# EAGLE board iMX233-OLinuXino-Mini_Rev_A (EAGLE 4.16), part 1 of 2
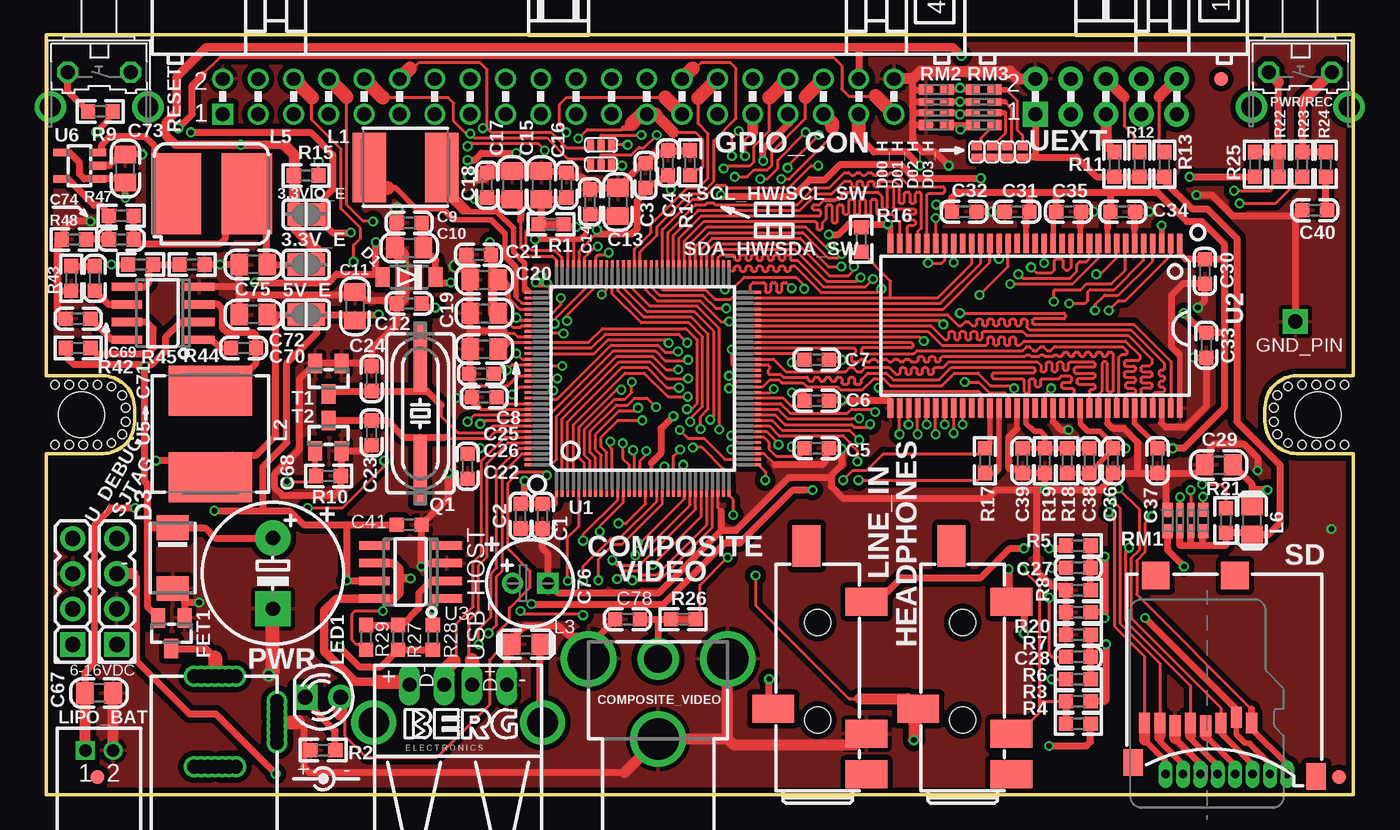
[diagram p1: board, top side]
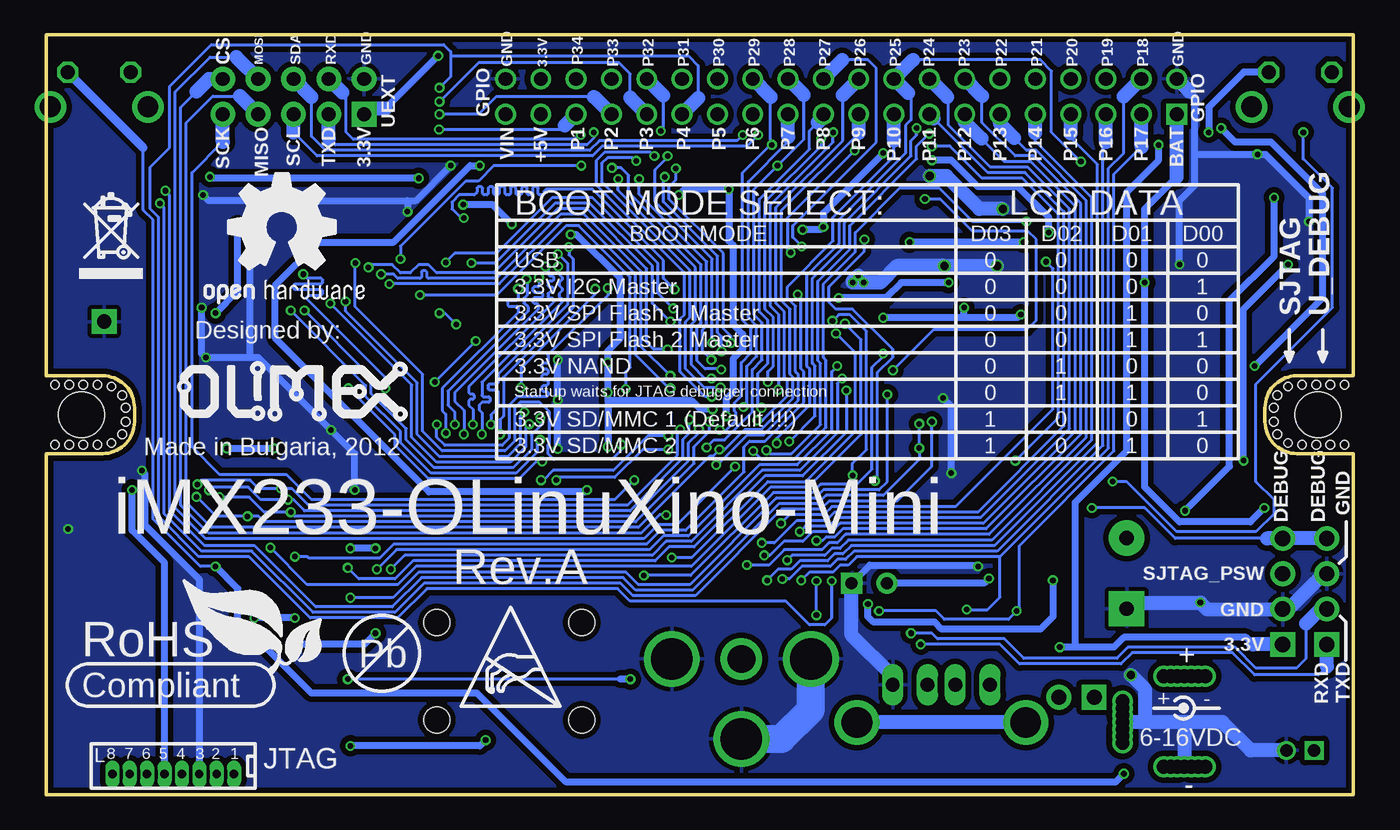
[diagram p2: board, bottom side, seen from below]

Size 93.98 x 54.61 mm. Coordinates in mm from the lower left corner, seen from the top.
Copper layers (1*16): Top 0.035mm / dielectric 0.5mm / Bottom 0.035mm
Design rules "default": minimum track width 0.0051mm, minimum drill 0.3mm, track to track 0.15mm, track to pad 0.2mm, pad to pad 0.2mm, via to via 0.2mm, smd to smd 1mil, copper to edge 10mil, drill to drill 8mil, minimum pad ring 6mil, minimum via ring 0.15mm, stop-mask expansion 4mil, vias tented up to drill 25mil, thermal gap 12mil
Net classes: 1 pwr: width 0.5 mm, clearance 0.24 mm

## Footprints (pad centres in the part's own frame; a part is rotated, then mirrored left to right if it is on the bottom)
SJ = smd 1.168 x 1.6: 1 -0.762,0; 2 0.762,0
C0603_DWS = smd 1.016 x 1.016: 1 -0.889,0; 2 0.889,0
C0805_5MIL_DWS = smd 1.27 x 1.524: 1 -1.016,0; 2 1.016,0
C0603_5MIL = smd 1.016 x 1.016: 1 -0.889,0; 2 0.889,0
E5-10,5 = drill 1.016 pad 2.54 round: + -2.54,0 | drill 1.016 pad 2.54 square: - 2.54,0
E2,5-6,3 = drill 0.864 pad 1.524 round: + -1.27,0 | drill 0.864 pad 1.524 square: - 1.27,0
VIDEO_CON = drill 3 round: GND1 -5,-5.75; GND2 0,0; GND3 5,-5.75 | drill 2 round: IO 0,-5.75
SJ_1_SMALLER = smd 0.508 x 0.762: 1 -0.381,0; 2 0.381,0
SOD-123 = smd 1 x 1.4: A 1.9,0; C -1.9,0
DO214AA = smd 1.778 x 2.286: A 2.177,0; C -2.177,0
SOT23 = smd 1 x 1.4: 1 -0.95,-1.1; 2 0.95,-1.1; 3 0,1.1
TEST_PAD40/70/SQUARE = drill 1.016 pad 1.778 square: P$1 0,0
BH40R = drill 1 square: 1 -24.13,-1.27 | drill 1 round: 2 -24.13,1.27; 3 -21.59,-1.27; 4 -21.59,1.27; 5 -19.05,-1.27; 6 -19.05,1.27; 7 -16.51,-1.27; 8 -16.51,1.27; 9 -13.97,-1.27; 10 -13.97,1.27; 11 -11.43,-1.27; 12 -11.43,1.27; 13 -8.89,-1.27; 14 -8.89,1.27; 15 -6.35,-1.27; 16 -6.35,1.27; 17 -3.81,-1.27; 18 -3.81,1.27; 19 -1.27,-1.27; 20 -1.27,1.27; 21 1.27,-1.27; 22 1.27,1.27; 23 3.81,-1.27; 24 3.81,1.27; 25 6.35,-1.27; 26 6.35,1.27; 27 8.89,-1.27; 28 8.89,1.27; 29 11.43,-1.27; 30 11.43,1.27; 31 13.97,-1.27; 32 13.97,1.27; 33 16.51,-1.27; 34 16.51,1.27; 35 19.05,-1.27; 36 19.05,1.27; 37 21.59,-1.27; 38 21.59,1.27; 39 24.13,-1.27; 40 24.13,1.27
PJ-W47S-05D2-LF_5PIN_V2 = smd 2 x 3: 1 2.1,-0.5; 2 14.5,-0.5; 3 6.8,6.2; 5 5,-0.5 | smd 3 x 2: 4 18.5,3.8 | hole 1.9: 6,3; 13,3
WU08S = drill 0.6 pad 0.991 long: 1 -4.375,0; 2 -3.125,0; 3 -1.875,0; 4 -0.625,0; 5 0.625,0; 6 1.875,0; 7 3.125,0; 8 4.375,0
L5852 = smd 2.4 x 5: 1 -2.6,0; 2 2.6,0
8X8MM_3131 = smd 3.6 x 6: 1 -3.1,0; 2 3.1,0
L0805_5MIL_DWS = smd 1.27 x 1.524: 1 -1.016,0; 2 1.016,0
SD75 = smd 5.8 x 3.6: 1 0,2.55; 2 0,-2.55
LED-3.0MM = drill 1.092 pad 1.778 round: A -1.27,0 | drill 1.092 pad 1.778 square: K 1.27,0
DW02R = drill 0.9 square: 1 -1,0 | drill 0.9 round: 2 1,0
PWR_JACK_UNI_MILLING = drill 1 round: + 0,4.75; +1 0,5.25; +2 0,5.75; +3 0,6.25; +4 0,4.25; +5 0,3.75; +6 0,3.25; - -6.5,4.75; -1 -6.5,5.25; -2 -6.5,5.75; -3 -6.5,4.25; -4 -6.5,3.75; -5 -6.5,6.25; -6 -6.5,3.25; -- -3.3,0.3; --1 -3.8,0.3; --2 -4.3,0.3; --3 -4.8,0.3; --4 -2.8,0.3; --5 -2.3,0.3; --6 -1.8,0.3
B3F-31XX = drill 1.016 octagon: 1 -2.261,-1.245; 2 2.261,-1.245 | drill 1.499 pad 2.159 round: 3 -3.505,1.245; 4 3.505,1.245
HC49/SMD2_THIN = smd 5 x 1: 1 -4.064,0; 2 4.064,0
0603_0R = smd 1.016 x 1.016: 1 -0.889,0; 2 0.889,0
R0603_5MIL_DWS = smd 1.016 x 1.016: 1 -0.889,0; 2 0.889,0
R0603_5MIL_DWS_NA = smd 1.016 x 1.016: 1 -0.889,0; 2 0.889,0
R0603_5MIL = smd 1.016 x 1.016: 1 -0.889,0; 2 0.889,0
R_MATRIX_4 = smd 1.016 x 0.762: 1.1 -0.762,1.27; 1.2 0.762,1.27; 4.1 -0.762,-1.27; 4.2 0.762,-1.27 | smd 1.016 x 0.508: 2.1 -0.762,0.381; 2.2 0.762,0.381; 3.1 -0.762,-0.381; 3.2 0.762,-0.381
SJ_2_SMALLER = smd 0.508 x 0.762: 1 -0.762,0; 2 0,0; 3 0.762,0
TFR-MEM-CON = smd 0.8 x 1.5: 1 -3.2,10.7; 2 -2.1,10.3; 3 -1,10.7; 4 0.1,10.9; 5 1.2,10.7; 6 2.3,10.9; 7 3.4,10.7; 8 4.5,10.7 | smd 2 x 2: 9 3.7,0.1; 10 -2,0.1 | smd 1.4 x 1.9: 11 5.3,13.55; 12 -7.85,14.55
HN1X4 = drill 1.1 pad 1.778 square: 1 -3.81,0 | drill 1.1 pad 1.778 round: 2 -1.27,0; 3 1.27,0; 4 3.81,0
TQFP128LD = smd 0.2 x 1.5: 1 -6.2,-7.75; 2 -5.8,-7.75; 3 -5.4,-7.75; 4 -5,-7.75; 5 -4.6,-7.75; 6 -4.2,-7.75; 7 -3.8,-7.75; 8 -3.4,-7.75; 9 -3,-7.75; 10 -2.6,-7.75; 11 -2.2,-7.75; 12 -1.8,-7.75; 13 -1.4,-7.75; 14 -1,-7.75; 15 -0.6,-7.75; 16 -0.2,-7.75; 17 0.2,-7.75; 18 0.6,-7.75; 19 1,-7.75; 20 1.4,-7.75; 21 1.8,-7.75; 22 2.2,-7.75; 23 2.6,-7.75; 24 3,-7.75; 25 3.4,-7.75; 26 3.8,-7.75; 27 4.2,-7.75; 28 4.6,-7.75; 29 5,-7.75; 30 5.4,-7.75; 31 5.8,-7.75; 32 6.2,-7.75; 65 6.2,7.75; 66 5.8,7.75; 67 5.4,7.75; 68 5,7.75; 69 4.6,7.75; 70 4.2,7.75; 71 3.8,7.75; 72 3.4,7.75; 73 3,7.75; 74 2.6,7.75; 75 2.2,7.75; 76 1.8,7.75; 77 1.4,7.75; 78 1,7.75; 79 0.6,7.75; 80 0.2,7.75; 81 -0.2,7.75; 82 -0.6,7.75; 83 -1,7.75; 84 -1.4,7.75; 85 -1.8,7.75; 86 -2.2,7.75; 87 -2.6,7.75; 88 -3,7.75; 89 -3.4,7.75; 90 -3.8,7.75; 91 -4.2,7.75; 92 -4.6,7.75; 93 -5,7.75; 94 -5.4,7.75; 95 -5.8,7.75; 96 -6.2,7.75 | smd 1.5 x 0.2: 33 7.75,-6.2; 34 7.75,-5.8; 35 7.75,-5.4; 36 7.75,-5; 37 7.75,-4.6; 38 7.75,-4.2; 39 7.75,-3.8; 40 7.75,-3.4; 41 7.75,-3; 42 7.75,-2.6; 43 7.75,-2.2; 44 7.75,-1.8; 45 7.75,-1.4; 46 7.75,-1; 47 7.75,-0.6; 48 7.75,-0.2; 49 7.75,0.2; 50 7.75,0.6; 51 7.75,1; 52 7.75,1.4; 53 7.75,1.8; 54 7.75,2.2; 55 7.75,2.6; 56 7.75,3; 57 7.75,3.4; 58 7.75,3.8; 59 7.75,4.2; 60 7.75,4.6; 61 7.75,5; 62 7.75,5.4; 63 7.75,5.8; 64 7.75,6.2; 97 -7.75,6.2; 98 -7.75,5.8; 99 -7.75,5.4; 100 -7.75,5; 101 -7.75,4.6; 102 -7.75,4.2; 103 -7.75,3.8; 104 -7.75,3.4; 105 -7.75,3; 106 -7.75,2.6; 107 -7.75,2.2; 108 -7.75,1.8; 109 -7.75,1.4; 110 -7.75,1; 111 -7.75,0.6; 112 -7.75,0.2; 113 -7.75,-0.2; 114 -7.75,-0.6; 115 -7.75,-1; 116 -7.75,-1.4; 117 -7.75,-1.8; 118 -7.75,-2.2; 119 -7.75,-2.6; 120 -7.75,-3; 121 -7.75,-3.4; 122 -7.75,-3.8; 123 -7.75,-4.2; 124 -7.75,-4.6; 125 -7.75,-5; 126 -7.75,-5.4; 127 -7.75,-5.8; 128 -7.75,-6.2
66TSOP-II = smd 0.4 x 1.4: 1 -10.4,-5.925; 2 -9.75,-5.925; 3 -9.1,-5.925; 4 -8.45,-5.925; 5 -7.8,-5.925; 6 -7.15,-5.925; 7 -6.5,-5.925; 8 -5.85,-5.925; 9 -5.2,-5.925; 10 -4.55,-5.925; 11 -3.9,-5.925; 12 -3.25,-5.925; 13 -2.6,-5.925; 14 -1.95,-5.925; 15 -1.3,-5.925; 16 -0.65,-5.925; 17 0,-5.925; 18 0.65,-5.925; 19 1.3,-5.925; 20 1.95,-5.925; 21 2.6,-5.925; 22 3.25,-5.925; 23 3.9,-5.925; 24 4.55,-5.925; 25 5.2,-5.925; 26 5.85,-5.925; 27 6.5,-5.925; 28 7.15,-5.925; 29 7.8,-5.925; 30 8.45,-5.925; 31 9.1,-5.925; 32 9.75,-5.925; 33 10.4,-5.925; 34 10.4,5.925; 35 9.75,5.925; 36 9.1,5.925; 37 8.45,5.925; 38 7.8,5.925; 39 7.15,5.925; 40 6.5,5.925; 41 5.85,5.925; 42 5.2,5.925; 43 4.55,5.925; 44 3.9,5.925; 45 3.25,5.925; 46 2.6,5.925; 47 1.95,5.925; 48 1.3,5.925; 49 0.65,5.925; 50 0,5.925; 51 -0.65,5.925; 52 -1.3,5.925; 53 -1.95,5.925; 54 -2.6,5.925; 55 -3.25,5.925; 56 -3.9,5.925; 57 -4.55,5.925; 58 -5.2,5.925; 59 -5.85,5.925; 60 -6.5,5.925; 61 -7.15,5.925; 62 -7.8,5.925; 63 -8.45,5.925; 64 -9.1,5.925; 65 -9.75,5.925; 66 -10.4,5.925
SOIC8 = smd 0.6 x 2.2: 1 -1.905,-2.6; 2 -0.635,-2.6; 3 0.635,-2.6; 4 1.905,-2.6; 5 1.905,2.6; 6 0.635,2.6; 7 -0.635,2.6; 8 -1.905,2.6
SOT23-5 = smd 0.55 x 1.2: 1 -0.95,-1.3; 2 0,-1.3; 3 0.95,-1.3; 4 0.95,1.3; 5 -0.95,1.3
FIDUCIAL-1X2 = smd 1 x 1: 1 0,0
JM42_PACTEC-101X61X25_MILLED = hole 3.3: 2.54,27.305; 91.44,27.305 | hole 0.6: 0.635,29.464; 1.651,29.464; 2.667,29.464; 3.683,29.464; 4.699,29.337; 5.461,28.702; 5.715,27.813; 5.715,26.797; 5.461,25.908; 4.699,25.273; 3.683,25.146; 2.667,25.146; 1.651,25.146; 0.635,25.146; 93.345,29.464; 92.329,29.464; 91.313,29.464; 90.297,29.464; 89.281,29.337; 88.519,28.702; 88.265,27.813; 88.265,26.797; 88.519,25.908; 89.281,25.273; 90.297,25.146; 91.313,25.146; 92.329,25.146; 93.345,25.146
BH10R = drill 1 pad 1.778 square: 1 -5.08,-1.27 | drill 1 pad 1.778 round: 2 -5.08,1.27; 3 -2.54,-1.27; 4 -2.54,1.27; 5 0,-1.27; 6 0,1.27; 7 2.54,-1.27; 8 2.54,1.27; 9 5.08,-1.27; 10 5.08,1.27
USB_PN87520_HOST_PTH = drill 1 long: 1 -3.5,2.71; 2 -1,2.71; 3 1,2.71; 4 3.5,2.71 | drill 2.2 round: P$1 6.07,0; P$2 -6.07,0

## Placement (x,y rotation side)
3.3V_E  Open  [SJ]  18.7,38.1 0 top
3.3VIO_E  Open  [SJ]  18.7,41.7 0 top
5V_E  Open  [SJ]  18.7,34.5 0 top
C1  100nF  [C0603_DWS]  35.7,20.02 90 top
C2  100nF  [C0603_DWS]  34.1,20.02 90 top
C3  100nF  [C0603_DWS]  43.1,44.5 270 top
C4  100nF  [C0603_DWS]  44.7,45.4 270 top
C5  100nF  [C0603_DWS]  55.4,24.9 180 top
C6  100nF  [C0603_DWS]  55.4,28.3 180 top
C7  100nF  [C0603_DWS]  55.4,31.25 180 top
C8  22uF/6.3V  [C0805_5MIL_DWS]  31.5,32.02 0 top
C9  100nF  [C0603_DWS]  26.1,41.1 0 top
C10  22uF/6.3V  [C0805_5MIL_DWS]  26.1,39.3 0 top
C11  22uF/6.3V  [C0805_5MIL_DWS]  22.2,35.1 270 top
C12  100nF  [C0603_DWS]  26.1,35.3 0 top
C13  22uF/6.3V  [C0805_5MIL_DWS]  41.1,42.6 270 top
C14  100nF  [C0603_DWS]  39.1,42.6 270 top
C15  22uF/6.3V  [C0805_5MIL_DWS]  35.6,43.8 270 top
C16  100nF  [C0603_DWS]  37.4,43.8 270 top
C17  22uF/6.3V  [C0805_5MIL_DWS]  33.5,43.8 270 top
C18  100nF  [C0603_DWS]  31.7,43.8 270 top
C19  22uF/6.3V  [C0805_5MIL_DWS]  31.5,34.6 0 top
C20  22uF/6.3V  [C0805_5MIL_DWS]  31.5,37 0 top
C21  100nF  [C0603_DWS]  31.1,38.8 0 top
C22  100nF  [C0603_DWS]  30.3,23.6 90 top
C23  33pF  [C0603_DWS]  23.4,26 90 top
C24  33pF  [C0603_DWS]  23.4,29.9 270 top
C25  100nF  [C0603_DWS]  31.3,30.25 0 top
C26  1uF  [C0603_DWS]  31.5,28.55 0 top
C27  1uF  [C0603_DWS]  74.2,16.3 180 top
C28  1uF  [C0603_DWS]  74.2,9.9 180 top
C29  22uF/6.3V  [C0805_5MIL_DWS]  84.3,23.7 0 top
C30  100nF  [C0603_DWS]  83.3,37.6 90 top
C31  100nF  [C0603_DWS]  69.8,41.9 0 top
C32  100nF  [C0603_DWS]  66,41.9 180 top
C33  100nF  [C0603_DWS]  83.4,32.3 90 top
C34  100nF  [C0603_DWS]  77.4,41.9 180 top
C35  100nF  [C0603_DWS]  73.5,41.9 180 top
C36  100nF  [C0603_DWS]  76.7,24 90 top
C37  100nF  [C0603_DWS]  79.9,24 90 top
C38  100nF  [C0603_DWS]  75,24 90 top
C39  100nF  [C0603_DWS]  70.2,24 90 top
C40  100nF  [C0603_DWS]  91.2,42 180 top
C41  100nF  [C0603_5MIL]  26.1,19.4 0 top
C67  22uF/6.3V  [C0805_5MIL_DWS]  3.8,7.3 180 top
C68  470uF/25V/LOWESR/105C  [E5-10,5]  16.3,15.9 270 top
C69  100nF  [C0603_DWS]  2.3,34.2 180 top
C70  10nF  [C0603_DWS]  14.2,32.1 0 top
C71  3.3nF  [C0603_DWS]  3.5,37.1 90 top
C72  22uF/6.3V  [C0805_5MIL_DWS]  14.9,34.5 180 top
C73  22uF/6.3V  [C0805_5MIL_DWS]  5.7,45 90 top
C74  22pF  [C0603_DWS]  5.4,39.9 180 top
C75  22uF/6.3V  [C0805_5MIL_DWS]  14.9,38.1 180 top
C76  100uF/35V/LOWESR/105C/6.3x11mm_RM2.5  [E2,5-6,3]  34.8,15.2 0 top
C78  51pF  [C0603_DWS]  41.8,12.6 180 top
COMPOSITE_VIDEO  VIDEO_CON  [VIDEO_CON]  44,4 180 top
D00_H  Close  [SJ_1_SMALLER]  66.9,46.2 270 top
D1  1N5819(S4SOD-123)  [SOD-123]  26.1,37.2 180 top
D01_H  Open  [SJ_1_SMALLER]  68,46.2 270 top
D02_H  Open  [SJ_1_SMALLER]  69.1,46.2 270 top
D3  SMBJ16A  [DO214AA]  9.1,17 270 top
D03_H  Close  [SJ_1_SMALLER]  70.2,46.2 270 top
FET1  IRLML6402  [SOT23]  9,11.6 180 top
GND_PIN  TESTPAD3  [TEST_PAD40/70/SQUARE]  89.8,34 0 top
GPIO_CON  BH40R  [BH40R]  36.83,50.16 0 top
HEADPHONES  AUDIO_JACK_5PINPJ-W47S-05D2-LF_V2  [PJ-W47S-05D2-LF_5PIN_V2]  68.89,-0.64 90 top
JTAG  NA(WU08S)  [WU08S]  84.85,1.47 180 bottom
L1  15uH/1.3A/20%  [L5852]  25.84,45.09 0 top
L2  10uH/3.15A/20%  [8X8MM_3131]  11.81,25.92 270 top
L3  FB0805/600R/200mA(201209-601)  [L0805_5MIL_DWS]  34.5,10.8 0 top
L5  4.7uH/2.8A/20%  [SD75]  11.88,43.18 90 top
L6  CL470nH/0805/1.76R/250mA  [L0805_5MIL_DWS]  86.7,19.7 90 top
LED1  LED/GREEN/3MM  [LED-3.0MM]  19.9,7 180 top
LINE_IN  AUDIO_JACK_5PINPJ-W47S-05D2-LF_V2  [PJ-W47S-05D2-LF_5PIN_V2]  58.47,-0.64 90 top
LIPO_BAT  DW02R  [DW02R]  3.81,3.17 0 top
PWR  YDJ-1136  [PWR_JACK_UNI_MILLING]  16.89,8.51 90 top
PWR/REC  TV-06B  [B3F-31XX]  90.17,50.67 180 top
Q1  Q24.000MHz/HC-49SM/SMD/20ppm/20pF  [HC49/SMD2_THIN]  26.9,27.4 270 top
R1  0R(Board_Mounted)  [0603_0R]  36.3,41 180 top
R2  560R  [R0603_5MIL_DWS]  19.9,3.2 0 top
R3  110R  [R0603_5MIL_DWS]  74.2,6.7 0 top
R4  110R  [R0603_5MIL_DWS]  74.2,5.1 0 top
R5  10k  [R0603_5MIL_DWS]  74.2,17.9 180 top
R6  10k  [R0603_5MIL_DWS]  74.2,8.3 180 top
R7  4.7k  [R0603_5MIL_DWS]  74.2,11.5 0 top
R8  4.7k  [R0603_5MIL_DWS]  74.2,14.7 0 top
R9  47k  [R0603_5MIL_DWS]  3.9,49.1 180 top
R10  47k  [R0603_5MIL_DWS]  20.3,22.9 0 top
R11  2.2k  [R0603_5MIL_DWS]  76.8,45.3 270 top
R12  2.2k  [R0603_5MIL_DWS]  78.6,45.3 270 top
R13  47k  [R0603_5MIL_DWS]  80.4,45.3 270 top
R14  47k  [R0603_5MIL_DWS]  46.3,45.4 270 top
R15  47k  [R0603_5MIL_DWS]  18.7,44.5 0 top
R16  10k  [R0603_5MIL_DWS]  58.6,39.9 90 top
R17  110R  [R0603_5MIL_DWS]  67.5,24 90 top
R18  1k/1%  [R0603_5MIL_DWS]  73.4,24 270 top
R19  1k/1%  [R0603_5MIL_DWS]  71.8,24 90 top
R20  1M  [R0603_5MIL_DWS]  74.2,13.1 180 top
R21  10k  [R0603_5MIL_DWS]  84.8,19.7 270 top
R22  0R(Board_Mounted)  [0603_0R]  88.6,45.3 270 top
R23  1k  [R0603_5MIL_DWS]  90.3,45.3 90 top
R24  1k  [R0603_5MIL_DWS]  92,45.3 90 top
R25  NA(10k)  [R0603_5MIL_DWS_NA]  86.9,45.3 270 top
R26  0R(Board_Mounted)  [0603_0R]  45.8,12.6 180 top
R27  10K  [R0603_5MIL]  25.3,11.3 270 top
R28  10K  [R0603_5MIL]  27.8,11.3 270 top
R29  1K  [R0603_5MIL]  23,11.3 90 top
R42  47k  [R0603_5MIL_DWS]  2.3,32.1 0 top
R43  2.2k  [R0603_5MIL_DWS]  1.8,37.1 270 top
R44  1.1k/1%  [R0603_5MIL_DWS]  10.5,38.1 0 top
R45  4.99k/1%  [R0603_5MIL_DWS]  6.8,38.1 180 top
R47  4.99k/1%  [R0603_5MIL_DWS]  5.4,41.6 180 top
R48  1.1k/1%  [R0603_5MIL_DWS]  2,39.9 180 top
RESET  TV-06B  [B3F-31XX]  3.81,50.67 180 top
RM1  RA1206_(4X0603)_4B8_100K  [R_MATRIX_4]  81.9,19.7 270 top
RM2  RA1206_(4X0603)_4B8_47K  [R_MATRIX_4]  64,49.4 0 top
RM3  RA1206_(4X0603)_4B8_4.7K  [R_MATRIX_4]  67.4,49.4 0 top
SCL_HW/SCL_SW  SCL_HW:Open/SCL_SW:Close  [SJ_2_SMALLER]  39.9,46.7 0 top
SD  MICRO  [TFR-MEM-CON]  83.46,15.85 180 top
SDA_HW/SDA_SW  SDA_HW:Open/SDA_SW:Close  [SJ_2_SMALLER]  39.9,45.3 0 top
SJTAG  (NA)HN1X4  [HN1X4]  5.08,14.61 90 top
T1  BC846B  [SOT23]  20.3,29.9 180 top
T2  BC846B  [SOT23]  20.3,25.8 0 top
U1  MCIMX233DAG4B_LD  [TQFP128LD]  42.9,29.9 0 top
U2  HY5DU121622D(L)T(P)-J  [66TSOP-II]  71.1,33.7 180 top
U3  MIC2075-2YM  [SOIC8]  26.2,16 90 top
U5  MP1482DS  [SOIC8]  8.4,34.6 90 top
U6  SY8008C(AA)C  [SOT23-5]  2.4,45.2 90 top
U$1  FIDUCIAL1X2  [FIDUCIAL-1X2]  3.68,1.27 180 top
U$2  FIDUCIAL1X2  [FIDUCIAL-1X2]  92.95,1.27 180 top
U$3  FIDUCIAL1X2  [FIDUCIAL-1X2]  84.45,51.44 180 top
U$5  [LOGO-OPENHARDWARE_8X8]  77.05,40.7 0 bottom
U$6  [JM42_PACTEC-101X61X25_MILLED]  0,0 0 top
U$8  [OLIMEX1_V]  66.85,26.73 0 bottom
U$9  [PB]  69.85,10.16 0 bottom
U$10  [ESD_SYMBOL]  64.14,6.35 0 bottom
U$11  [RECYCLE_BIN1/8]  91.6,37.09 0 bottom
U$12  [ROHS]  91.44,6.99 0 bottom
U_DEBUG  NA(HN1X4)  [HN1X4]  1.91,14.61 90 top
UEXT  BH10R  [BH10R]  76.2,50.16 0 top
USB_HOST  USB_A  [USB_PN87520_HOST_PTH]  29.62,5.19 0 top

## Tracks (layer width: path | path; a pad name or v marks a point on that pad's centre or on a via)
+5V  (via drill 0.4)
  Top 0.2: v33.8,34.27 33.98,34.1 U1.102
  Top 0.5: C12.2 27.29,35 v27.99,35 | 21.6,19.4 v21.6,15.4 21.64,15.37 U3.7 | 21.6,19.4 C41.1 | 22.2,34.5 5V_E.2 19.46,33.16 17.3,31 17.3,25.3 15.6,23.6 15.6,20.4 | 22.2,34.5 v23.9,34.5 | 21.6,19.4 18.5,19.4 17.5,20.4 15.6,20.4 | v12.1,20.4 15.6,20.4 | U6.4 1.65,46.15 2.4,45.4 2.4,44.6 2.75,44.25 U6.1 5.43,44.25 C73.1 v5.7,42.9 | v34.9,13.7 44.4,13.7 48.8,18.1 49.9,18.1 53.7,21.9 v55.1,21.9 | v62.8,45.2 61.8,46.2 59.5,46.2 58.42,47.28 | 22.2,34.5 C11.2
  Top 1: 58.42,47.28 GPIO_CON.37
  Bottom 0.5: 27.99,34.27 v33.8,34.27 | 27.99,34.27 v27.99,35 | v23.9,34.5 24.12,34.27 27.99,34.27 | v12.1,20.4 8.9,23.6 8.9,35.5 5.7,38.7 v5.7,42.9 | v21.6,15.4 21.6,12.8 22.5,11.9 29.6,11.9 30.1,12.4 34.5,12.4 34.9,12.8 v34.9,13.7 | v55.1,21.9 55.25,21.75 66.45,21.75 77.5,32.8 77.5,36.6 74.4,39.7 69,39.7 63.5,45.2 v62.8,45.2
+5V_HOST_PWR  (via drill 0.4)
  Top 0.6: 25.4,15.54 25.4,16.2 24.96,16.64 U3.6 | 25.4,15.54 25.4,14.5 25,14.1 U3.8 20.89,14.1 20,13.2 20,10.3 22.2,8.1 23.9,8.1 | 25.4,15.54 v26.2,15.54
  Top 1: USB_HOST.1 26.12,8.1 23.9,8.1
  Bottom 0.5: v26.2,15.54 26.53,15.2 C76.+
+15V  (via drill 0.4)
  Top 0.2: 59.66,50.2 57.7,50.2 57.2,50.7 57.2,52.4 56.6,53 12.5,53 11.3,51.8
  Top 0.5: R42.1 1.6,31.91 1.6,31.3 2,30.9 7.1,30.9 | 7.1,30.9 7.6,30.9 8.6,31.9 8.6,32.9 9.66,33.97 U5.2 | FET1.2 7.3,13.45 7.3,19.18 | 7.3,19.18 D3.C 11.42,19.18 12.16,18.44 C68.+ | 7.3,19.18 7.3,22.3 7.1,22.5 v7.1,30.8 7.1,30.9 | 11.3,51.8 10.5,51 10.5,48.9 v9.5,47.9
  Top 1: 59.66,50.2 GPIO_CON.39
  Bottom 0.5: v9.5,47.9 8.5,46.9 5.9,46.9 2.2,43.2 2.2,35.7 v7.1,30.8
+24V  (via drill 0.4)
  Top 0.2: U1.103 34.2,33.7 34.1,33.6 33.52,33.6 C19.2 | U1.100 34.05,34.9 33.3,35.65 | 33.2,35.9 33.2,35.75 33.3,35.65 | 33.3,35.65 33.3,35.9
  Top 0.4: 32.8,37 33.2,36.6 33.2,35.9
  Top 0.5: C19.2 | C20.2 32.8,37 | C67.2 2.81,7.3 2.81,8.81 3.5,9.5 3.5,19.4 4.7,20.6 v6.4,20.6 | v15,36.8 20.3,36.8 20.9,37.4 23.7,37.4 | 23.7,37.4 v23.7,39.7 | 23.7,37.4 24.2,37.4 D1.A | 31.9,38.8 C21.2
  Top 0.7: 32.1,37 32.1,34.6 C19.2 | 32.3,36.78 C20.2 32.1,37 | v31.9,39.7 31.9,38.8 32.1,38.6 32.1,37
  Top 0.8: LIPO_BAT.1 2.81,7.3
  Bottom 0.5: v6.4,20.6 7.4,19.6 12.5,19.6 15,22.1 v15,36.8 15,42.1 12.7,44.4 | v23.7,39.7 v31.9,39.7
  Bottom 1: 12.7,44.4 GPIO_CON.1
A0
  Top 0.2: U1.76 44.7,40.4 46.7,42.4 47.4,42.4 47.52,42.52 47.98,42.52 48.1,42.4 54,42.4 55.2,43.6 56.3,43.6 57.4,44.7 57.7,44.7 57.9,44.5 58.1,44.5 58.3,44.7 58.5,44.7 58.7,44.5 58.9,44.5 59.1,44.7 59.3,44.7 59.5,44.5 59.7,44.5 59.9,44.7 60.1,44.7 60.3,44.5 60.5,44.5 60.7,44.7 61.1,44.7 62.1,43.7 64.47,43.7 64.58,43.6 64.58,43.3 64.47,43.2 63.4,43.2 63.3,43.1 U2.29
A1
  Top 0.2: U1.75 45.1,40.2 46.9,42 54.2,42 55.4,43.2 56.5,43.2 57.4,44.1 57.77,44.1 57.9,43.98 57.9,43.8 58,43.7 58.2,43.7 58.3,43.8 58.3,44 58.4,44.1 58.6,44.1 58.7,44 58.7,43.8 58.8,43.7 59,43.7 59.1,43.8 59.1,44 59.2,44.1 59.4,44.1 59.5,44 59.5,43.8 59.6,43.7 59.8,43.7 59.9,43.8 59.9,43.98 60.02,44.1 61,44.1 61.3,43.8 61.3,42.6 61.4,42.5 61.6,42.5 61.7,42.6 61.7,43.2 61.8,43.3 62,43.3 62.1,43.2 62.1,42.6 62.2,42.5 62.4,42.5 62.5,42.6 62.5,43.2 62.6,43.3 62.8,43.3 62.9,43.2 62.9,40.7 62.65,40.45 U2.30
A2
  Top 0.2: U1.74 45.5,40 47.1,41.6 55.6,41.6 55.7,41.7 55.7,41.9 55.6,42 55.2,42 55.1,42.1 55.1,42.3 55.2,42.4 55.6,42.4 56,42.8 57.08,42.8 57.2,42.92 57.2,43.17 57.33,43.3 59.8,43.3 60.1,43 60.1,42.2 60.2,42.1 60.4,42.1 60.5,42.2 60.5,43.6 60.6,43.7 60.8,43.7 60.9,43.6 60.9,42.2 61,42.1 62.4,42.1 62.5,42 62.5,41.8 62.4,41.7 61.7,41.7 61.6,41.6 61.6,41.4 61.7,41.3 62.4,41.3 62.5,41.2 62.5,41 62.4,40.9 62,40.9 61.9,40.8 61.9,40.3 62,40.2 U2.31 62,39.6
A3
  Top 0.2: U1.73 45.9,39.8 47.3,41.2 55.3,41.2 55.4,41.1 55.4,40.7 55.5,40.6 55.7,40.6 55.8,40.7 55.8,41.1 56.1,41.4 56.1,42.3 56.2,42.4 56.4,42.4 56.5,42.3 56.5,41.2 56.6,41.1 56.8,41.1 56.9,41.2 56.9,42.3 57,42.4 57.2,42.4 57.3,42.3 57.3,41.8 57.4,41.7 57.6,41.7 57.7,41.8 57.7,42.7 57.8,42.8 58,42.8 58.1,42.7 58.1,41.8 58.2,41.7 58.4,41.7 58.5,41.8 58.5,42.7 58.6,42.8 58.8,42.8 58.9,42.7 58.9,41.8 59,41.7 59.2,41.7 59.3,41.8 59.3,42.7 59.4,42.8 59.6,42.8 59.7,42.7 59.7,41.8 59.8,41.7 60.8,41.7 61.35,41.15 U2.32
A4  (via drill 0.4)
  Top 0.2: v61.35,25.9 U2.35 | U1.72 46.3,39.6 47.5,40.8 54.6,40.8 56.05,39.35 v56.4,39.35
  Bottom 0.2: v56.4,39.35 56.4,38.8 56.1,38.5 56.1,35 61.1,30 61.1,27.2 61.35,26.95 v61.35,25.9
A5  (via drill 0.4)
  Top 0.2: v62,26.6 U2.36 | U1.71 46.7,39.4 47.7,40.4 54.4,40.4 56.2,38.6 56.95,38.6 v57.2,38.85
  Bottom 0.2: v57.2,38.85 57.15,38.85 56.5,38.2 56.5,35.2 61.5,30.2 61.5,29.6 61.6,29.5 62.12,29.5 62.23,29.4 62.23,29.2 62.12,29.1 61.6,29.1 61.5,29 61.5,27.8 62,27.3 v62,26.6
A6  (via drill 0.4)
  Top 0.2: v62.65,25.9 U2.37 | U1.70 47.1,39.2 47.9,40 54.2,40 56.25,37.95 v57.17,37.95
  Bottom 0.2: v57.17,37.95 57.17,37.48 56.9,37.2 56.9,37 57.1,36.8 57.1,36.6 56.9,36.4 56.9,36.2 57.1,36 57.1,35.8 56.9,35.6 56.9,35.4 62.65,29.65 62.65,28.68 62.58,28.6 62.15,28.6 62.05,28.5 62.05,28.3 62.15,28.2 62.65,28.2 62.85,28 62.85,27.65 62.65,27.45 v62.65,25.9
A7  (via drill 0.4)
  Top 0.2: v63.3,26.6 U2.38 | U1.69 47.5,39 48.1,39.6 54,39.6 56.3,37.3 57.67,37.3 58.08,37.7 v58.08,37.95
  Bottom 0.2: v58.08,37.95 57.9,37.77 57.9,37.4 57.8,37.3 57.6,37.3 57.5,37.2 57.5,37 57.6,36.9 57.8,36.9 57.9,36.8 57.9,36.6 57.8,36.5 57.6,36.5 57.5,36.4 57.5,36.2 57.6,36.1 57.8,36.1 57.9,36 57.9,35.8 57.8,35.7 57.6,35.7 57.5,35.6 57.5,35.4 63.6,29.3 63.6,28.9 63.5,28.8 63.3,28.8 63.2,28.7 63.2,28.5 63.3,28.4 63.5,28.4 63.6,28.3 63.6,28 63.3,27.7 v63.3,26.6
A8  (via drill 0.4)
  Top 0.2: v63.95,25.9 U2.39 | U1.68 47.9,38.8 48.3,39.2 53.8,39.2 56.1,36.9 58.27,36.9 v58.55,37.17
  Bottom 0.2: v58.55,37.17 58.55,36.55 58.6,36.5 58.9,36.5 59,36.4 59,36.2 58.9,36.1 58.4,36.1 58.3,36 58.3,35.8 58.4,35.7 58.9,35.7 59,35.6 59,35.4 58.9,35.3 58.7,35.3 58.6,35.2 58.6,34.9 64.6,28.9 64.6,28.27 63.95,27.62 v63.95,25.9
A9  (via drill 0.4)
  Top 0.2: v64.6,26.6 U2.40 | U1.67 48.3,38.6 48.5,38.8 49.4,38.8 49.5,38.7 49.5,38.5 49.6,38.4 49.8,38.4 49.9,38.5 49.9,38.7 50,38.8 50.2,38.8 50.3,38.7 50.3,38.5 50.4,38.4 50.6,38.4 50.7,38.5 50.7,38.7 50.8,38.8 51,38.8 51.1,38.7 51.1,38.5 51.2,38.4 51.4,38.4 51.5,38.5 51.5,38.7 51.6,38.8 51.8,38.8 51.9,38.7 51.9,38.5 52,38.4 52.2,38.4 52.3,38.5 52.3,38.7 52.4,38.8 52.6,38.8 52.7,38.7 52.7,38.5 52.8,38.4 53,38.4 53.1,38.5 53.1,38.7 53.2,38.8 53.4,38.8 53.5,38.7 53.5,38.5 53.6,38.4 54,38.4 55.9,36.5 58.9,36.5 v59.45,37.05
  Bottom 0.2: v59.45,37.05 59.4,37 59.4,35.9 59.62,35.67 59.62,35.33 59.35,35.05 59.35,34.75 65.1,29 65.1,28 64.6,27.5 v64.6,26.6
A10  (via drill 0.4)
  Top 0.2: U1.66 48.7,36.4 v48.8,36.3 | v63.95,41.45 U2.28
  Bottom 0.2: v48.8,36.3 49.6,37.1 49.6,38.4 54.7,43.5 58.05,43.5 58.2,43.35 58.2,43.2 58.3,43.1 58.5,43.1 58.6,43.2 58.6,43.6 58.7,43.7 58.9,43.7 59,43.6 59,43.2 59.1,43.1 59.3,43.1 59.4,43.2 59.4,43.6 59.5,43.7 59.7,43.7 59.8,43.6 59.8,43.2 59.9,43.1 60.1,43.1 60.2,43.2 60.2,43.6 60.3,43.7 60.5,43.7 60.6,43.6 60.6,43.2 60.7,43.1 60.9,43.1 61,43.2 61,43.6 61.1,43.7 61.3,43.7 61.4,43.6 61.4,43.2 61.5,43.1 61.7,43.1 61.8,43.2 61.8,43.6 61.9,43.7 62.1,43.7 62.2,43.6 62.2,43.2 62.3,43.1 62.5,43.1 62.6,43.2 62.6,43.6 62.7,43.7 62.9,43.7 63,43.6 63,43.3 63.2,43.1 64.28,43.1 64.8,42.58 64.8,42.1 64.15,41.45 v63.95,41.45
A11  (via drill 0.4)
  Top 0.2: v65.25,25.98 U2.41 | U1.65 49.45,37.65 49.5,37.7 49.5,37.9 49.6,38 49.8,38 49.9,37.9 49.9,37.7 50,37.6 50.2,37.6 50.3,37.7 50.3,37.9 50.4,38 50.6,38 50.7,37.9 50.7,37.7 50.8,37.6 51,37.6 51.1,37.7 51.1,37.9 51.2,38 51.4,38 51.5,37.9 51.5,37.7 51.6,37.6 51.8,37.6 51.9,37.7 51.9,37.9 52,38 52.2,38 52.3,37.9 52.3,37.7 52.4,37.6 52.6,37.6 52.7,37.7 52.7,37.9 52.8,38 53,38 53.1,37.9 53.1,37.7 53.2,37.6 53.4,37.6 53.5,37.7 53.5,37.9 53.6,38 53.8,38 55.7,36.1 59.8,36.1 v60.05,36.35
  Bottom 0.2: v60.05,36.35 60.05,35.62 60.17,35.5 60.73,35.5 60.8,35.42 60.8,35.17 60.73,35.1 60.12,35.1 60.05,35.02 60.05,34.65 65.5,29.2 65.5,27.6 65.25,27.35 v65.25,25.98
A12  (via drill 0.4)
  Top 0.2: 65.9,27.8 U2.42 v65.9,26.6 | U1.64 50.65,36.62 50.83,36.8 51.6,36.8 51.7,36.7 51.7,36.2 51.8,36.1 52,36.1 52.1,36.2 52.1,36.7 52.2,36.8 52.4,36.8 52.5,36.7 52.5,36.2 52.6,36.1 52.8,36.1 52.9,36.2 52.9,36.7 53,36.8 53.2,36.8 v53.6,36.4
  Bottom 0.2: v65.9,26.6 65.9,25.7 65.3,25.1 61.2,25.1 60.7,25.6 60.7,28 60.1,28.6 58,28.6 57.9,28.7 57.9,28.9 58,29 58.25,29 58.35,29.1 58.35,29.3 58.25,29.4 58,29.4 57.9,29.5 57.9,29.7 58,29.8 58.25,29.8 58.35,29.9 58.35,30.1 58.25,30.2 58,30.2 57.9,30.3 57.9,30.5 58,30.6 58.25,30.6 58.35,30.7 58.35,30.9 58.25,31 58,31 57.9,31.1 57.9,31.6 53.6,35.9 v53.6,36.4
AUART1_RXD  (via drill 0.4)
  Top 0.2: v53.3,45.05 53.3,45.15 v55.55,47.4 | v45.45,30.55 44.55,30.55 43.6,31.5 41,31.5 36.7,27.2 36.7,24.1 36.3,23.7 U1.128 | U1.128 35.1,23.7 | U1.128 35.2,23.7
  Bottom 0.2: 72.7,50.48 72.4,50.17 72.4,47.6 71.9,47.1 56,47.1 55.7,47.4 v55.55,47.4 | v45.45,30.55 45.5,30.6 46.6,30.6 47.2,31.2 47.2,33.6 46.9,33.9 46.9,38.1 52.1,43.3 52.1,44.5 52.65,45.05 v53.3,45.05
  Bottom 1: 72.7,50.48 UEXT.4
AUART1_TXD  (via drill 0.4)
  Top 0.2: v51.35,44.25 51.85,44.25 52.6,45 52.6,45.6 v54.6,47.6 | v46.15,31.25 46.1,31.2 44.5,31.2 43.8,31.9 40.8,31.9 36.3,27.4 36.3,24.2 36.2,24.1 U1.127
  Bottom 0.2: 73.66,47.16 73.2,46.7 55.1,46.7 54.6,47.2 v54.6,47.6 | v46.15,31.25 46.8,31.9 46.8,33.4 46.5,33.7 46.5,38.3 51.35,43.15 v51.35,44.25
  Bottom 1: 73.66,47.16 UEXT.3
BA0  (via drill 0.4)
  Top 0.2: v65.25,38.25 U2.26 | U1.79 43.5,36.5 44.1,35.9 47.2,35.9 48.15,34.95 v48.9,34.95
  Bottom 0.2: v65.25,38.25 64.6,38.9 61.6,38.9 57.6,42.9 54.7,42.9 50,38.2 50,36.05 v48.9,34.95
BA1  (via drill 0.4)
  Top 0.2: v63.4,38.2 64.4,38.2 64.6,38.4 U2.27 | U1.80 43.1,36.3 43.9,35.5 47,35.5 48.5,34 v49.1,34
  Bottom 0.2: v63.4,38.2 61.7,38.2 57.4,42.5 54.9,42.5 50.4,38 50.4,35.3 v49.1,34
CASN
  Top 0.2: U2.22 67.85,38.25 64.5,34.9 U1.61
CKE  (via drill 0.4)
  Top 0.2: U1.78 43.9,36.7 44.3,36.3 47.4,36.3 48.1,35.6 49.2,35.6 49.5,35.9 49.5,36.5 50.2,37.2 53.9,37.2 54.5,36.6 v54.5,36.35 | U2.44 67.2,28.8 67,29 60.1,29 v59.85,29.25
  Bottom 0.2: v59.85,29.25 59.85,30.65 54.5,36 v54.5,36.35
CLK  (via drill 0.4)
  Top 0.2: U1.36 49.35,24.9 v49.25,24.8 | R17.2 67.11,24.5 60.2,24.5 59,23.3 58,23.3 v57.3,22.6
  Top 0.4: R17.2 67.85,25.24 U2.45
  Bottom 0.2: v49.25,24.8 51.1,24.8 53.1,22.8 57.1,22.8 v57.3,22.6
CLKN  (via drill 0.4)
  Top 0.2: U1.37 49.75,25.3 v49.25,25.8 | v58.4,22.6 66.99,22.6 R17.1
  Top 0.4: U2.46 68.5,23.4 68.21,23.11 R17.1
  Bottom 0.2: v49.25,25.8 50.7,25.8 53.2,23.3 57.52,23.3 58.23,22.6 v58.4,22.6
CS
  Top 0.2: U1.63 60.7,35.7 | U2.24 66.55,38.15 64.1,35.7 60.7,35.7 | 60.7,35.7 60.7,36.91 R16.1
CS_UEXT  (via drill 0.4)
  Top 0.2: v49.4,20.1 49.4,21.2 49.1,21.5 U1.32 | R13.1 80,46.59 80,50.16
  Top 0.8: UEXT.10 80,50.16
  Bottom 0.2: v49.4,20.1 49.9,20.1 51.2,18.8 82.3,18.8 84.3,20.8 84.3,49.4 83.17,50.53
  Bottom 1: 83.17,50.53 82.27,51.44 UEXT.10
D0  (via drill 0.4)
  Top 0.2: v76.4,34.8 77.1,35.5 77.6,35.5 80.85,38.75 U2.2 | U1.41 52.2,26.9 52.9,26.2 57.75,26.2 v58.45,25.5
  Bottom 0.2: v58.45,25.5 58.7,25.25 58.7,24.6 60.2,23.1 66.3,23.1 68.5,25.3 68.5,26.1 71,28.6 71,29.4 v76.4,34.8
D1  (via drill 0.4)
  Top 0.2: v75.4,34.8 75.4,35.2 76.1,35.9 77.1,35.9 79.55,38.35 U2.4 | U1.43 52.6,27.7 53.3,27 57.9,27 57.95,27.05 v58.45,27.05
  Bottom 0.2: v58.45,27.05 58.45,26.5 59.1,25.85 59.1,24.8 60.4,23.5 66.1,23.5 68.1,25.5 68.1,26.3 70.6,28.8 70.6,30 v75.4,34.8
D2  (via drill 0.4)
  Top 0.2: U2.5 78.9,38.4 76.8,36.3 75.05,36.3 74.9,36.15 74.9,35.5 74.7,35.3 v73.55,35.3 | U1.42 52.4,27.3 53.1,26.6 57.9,26.6 58.1,26.4 59.02,26.4 v59.25,26.62
  Bottom 0.2: v59.25,26.62 59.5,26.38 59.5,25 60.6,23.9 65.9,23.9 67.7,25.7 67.7,29.45 v73.55,35.3
D3  (via drill 0.4)
  Top 0.2: v72.45,35.45 72.45,36.2 72.55,36.3 74.4,36.3 74.8,36.7 76.6,36.7 77.6,37.7 U2.7 | U1.44 52.8,28.1 53.5,27.4 57.6,27.4 57.9,27.7 59.4,27.7 v59.6,27.5
  Bottom 0.2: v59.6,27.5 59.9,27.2 59.9,25.2 60.8,24.3 65.7,24.3 67.3,25.9 67.3,29.6 72.45,34.75 v72.45,35.45
D4  (via drill 0.4)
  Top 0.2: U1.47 51.52,29.3 52.02,29.8 52.7,29.8 52.9,29.6 54.4,29.6 54.7,29.3 56.9,29.3 57.1,29.1 58.7,29.1 59.5,29.9 60.2,29.9 60.7,29.4 64.4,29.4 65.3,30.3 67,30.3 67.9,29.4 69.4,29.4 v69.6,29.2 | v75.5,37.4 75.8,37.4 76.95,38.55 U2.8
  Bottom 0.2: v69.6,29.2 69.6,30 75.2,35.6 75.2,35.8 75.1,35.9 74.2,35.9 74.1,36 74.1,36.2 74.2,36.3 76.1,36.3 76.2,36.4 76.2,36.6 76.1,36.7 74.2,36.7 74.1,36.8 74.1,37 74.2,37.1 75.2,37.1 v75.5,37.4
D5  (via drill 0.4)
  Top 0.2: v69.3,36.7 73.8,36.7 75.65,38.55 U2.10 | U1.48 49.7,29.7 49.2,29.2 v49.1,29.2
  Bottom 0.2: v69.3,36.7 61.4,36.7 56.8,41.3 55.5,41.3 51.6,37.4 51.6,31.6 49.2,29.2 v49.1,29.2
D6  (via drill 0.4)
  Top 0.2: v69.9,37.4 70.2,37.1 73.6,37.1 74.1,37.6 74.1,38.1 74.3,38.3 74.8,38.3 75,38.5 U2.11 | U1.49 v49.1,30.1
  Bottom 0.2: v49.1,30.1 51.2,32.2 51.2,37.6 55.3,41.7 57,41.7 61.6,37.1 66.5,37.1 66.6,37.2 66.6,37.55 66.7,37.65 66.9,37.65 67,37.55 67,37.2 67.1,37.1 68.7,37.1 69,37.4 v69.9,37.4
D7  (via drill 0.4)
  Top 0.2: v70.8,37.9 71.2,37.5 72.3,37.5 72.5,37.7 72.5,38.4 72.6,38.5 73,38.5 73.1,38.4 73.1,37.9 73.3,37.7 73.5,37.7 73.7,37.9 U2.13 | U1.50 49.7,30.5 49.3,30.9 v49.3,32
  Bottom 0.2: v70.8,37.9 70.6,38.1 69.1,38.1 68.5,37.5 67.8,37.5 67.2,38.1 66.5,38.1 65.9,37.5 61.8,37.5 57.2,42.1 55.1,42.1 50.8,37.8 50.8,32.5 50.3,32 v49.3,32
D8
  Top 0.2: U2.54 73.7,28.7 73.9,28.9 73.9,29.1 73.8,29.2 73.1,29.2 73,29.3 73,29.5 73.1,29.6 73.6,29.6 73.7,29.7 73.7,30 73.6,30.1 73,30.1 72.8,29.9 71.6,29.9 71.5,29.8 71.5,29.4 71.4,29.3 71.2,29.3 71.1,29.4 71.1,29.8 71,29.9 70.8,29.9 70.7,29.8 70.7,29 70.6,28.9 70.4,28.9 70.3,29 70.3,29.8 70.2,29.9 68.1,29.9 68,30 68,30.2 68.1,30.3 71,30.3 71.1,30.4 71.1,30.6 71,30.7 65.1,30.7 64.2,29.8 60.9,29.8 60.4,30.3 59.08,30.3 58.6,29.82 58.6,29.6 58.5,29.5 58.2,29.5 58.1,29.6 58.1,29.9 58,30 57.8,30 57.7,29.9 57.7,29.6 57.6,29.5 57.3,29.5 57.2,29.6 57.2,29.9 57.1,30 56.9,30 56.8,29.9 56.8,29.8 56.7,29.7 56.5,29.7 56.4,29.8 56.4,29.9 56.3,30 56.1,30 56,29.9 56,29.8 55.9,29.7 55.7,29.7 55.6,29.8 55.6,29.9 55.5,30 55.3,30 55.2,29.9 55.2,29.8 55.1,29.7 54.9,29.7 54.8,29.8 54.8,29.9 54.7,30 53,30 52.8,30.2 52,30.2 51.9,30.3 51.9,30.5 52,30.6 52,30.8 51.9,30.9 U1.51
D9
  Top 0.2: U2.56 75,29 75.1,29.1 75.3,29.1 75.4,29.2 75.4,29.4 75.3,29.5 74.2,29.5 74.1,29.6 74.1,29.8 74.2,29.9 75.3,29.9 75.4,30 75.4,30.2 75.3,30.3 74,30.3 73.9,30.4 73.9,30.6 74,30.7 75.3,30.7 75.4,30.8 75.4,31 75.3,31.1 73.6,31.1 73.5,31 73.5,30.6 73.4,30.5 73.2,30.5 73.1,30.6 73.1,31 73,31.1 72.8,31.1 72.7,31 72.7,30.5 72.6,30.4 72.4,30.4 72.3,30.5 72.3,31 72.2,31.1 72,31.1 71.9,31 71.9,30.5 71.8,30.4 71.6,30.4 71.5,30.5 71.5,30.88 71.28,31.1 64.9,31.1 64.5,30.7 63.9,30.7 63.8,30.6 63.8,30.3 63.7,30.2 63.5,30.2 63.4,30.3 63.4,30.6 63.3,30.7 63.1,30.7 63,30.6 63,30.3 62.9,30.2 62.7,30.2 62.6,30.3 62.6,30.6 62.5,30.7 62.3,30.7 62.2,30.6 62.2,30.3 62.1,30.2 61.9,30.2 61.8,30.3 61.8,30.6 61.7,30.7 61.5,30.7 61.4,30.6 61.4,30.3 61.3,30.2 61.1,30.2 60.6,30.7 58.9,30.7 58.6,30.4 58.3,30.4 58,30.7 57.8,30.7 57.5,30.4 53.2,30.4 52.3,31.3 U1.52
D10
  Top 0.2: U2.57 75.65,28.75 75.9,29 75.9,31 76,31.1 76.2,31.1 76.3,31 76.3,29.02 76.4,28.93 76.6,28.93 76.7,29.02 76.7,31.7 76.6,31.8 76.4,31.8 76.3,31.7 76.3,31.6 76.2,31.5 76,31.5 75.9,31.6 75.9,31.7 75.8,31.8 75.6,31.8 75.5,31.7 75.5,31.6 75.4,31.5 75.2,31.5 75.1,31.6 75.1,31.7 75,31.8 74.8,31.8 74.7,31.7 74.7,31.6 74.6,31.5 74.4,31.5 74.3,31.6 74.3,31.7 74.2,31.8 74,31.8 73.9,31.7 73.9,31.6 73.8,31.5 73.6,31.5 73.5,31.6 73.5,31.7 73.4,31.8 73.2,31.8 73.1,31.7 73.1,31.6 73,31.5 72.8,31.5 72.7,31.6 72.5,31.6 72.4,31.5 71.8,31.5 71.7,31.6 71.5,31.6 71.4,31.5 70.8,31.5 70.7,31.6 70.5,31.6 70.4,31.5 64.45,31.5 64.3,31.35 64.3,31.2 64.2,31.1 64,31.1 63.9,31.2 63.9,31.4 63.8,31.5 63.6,31.5 63.5,31.4 63.5,31.2 63.4,31.1 63.2,31.1 63.1,31.2 63.1,31.4 63,31.5 62.8,31.5 62.7,31.4 62.7,31.2 62.6,31.1 62.2,31.1 62,31.3 61.8,31.3 61.6,31.1 61.4,31.1 61.2,31.3 61,31.3 60.8,31.1 60.6,31.1 60.4,31.3 60.2,31.3 60,31.1 59.8,31.1 59.6,31.3 59.4,31.3 59.2,31.1 59,31.1 58.8,31.3 58.6,31.3 58.4,31.1 58,31.1 57.9,31.2 57.9,31.5 58.2,31.8 58.2,32 58.1,32.1 U1.54
D11
  Top 0.2: U2.59 76.95,28.65 77.1,28.8 77.1,31.4 77.3,31.6 77.6,31.6 77.7,31.7 77.7,31.9 77.4,32.2 72.5,32.2 72.2,31.9 72,31.9 71.7,32.2 71.5,32.2 71.2,31.9 71,31.9 70.7,32.2 70.5,32.2 70.2,31.9 62.6,31.9 62.4,31.7 58.7,31.7 58.6,31.8 58.6,32 58.7,32.1 62.2,32.1 62.3,32.2 62.3,32.4 62.2,32.5 U1.55
D12
  Top 0.2: U2.60 77.6,28.7 77.7,28.8 78.2,28.8 78.3,28.9 78.3,29.1 78.2,29.2 77.7,29.2 77.6,29.3 77.6,29.5 77.7,29.6 78.2,29.6 78.3,29.7 78.3,29.9 78.2,30 77.6,30 77.5,30.1 77.5,30.3 77.6,30.4 78.2,30.4 78.3,30.5 78.3,30.7 78.2,30.8 77.6,30.8 77.5,30.9 77.5,31.1 77.6,31.2 78.53,31.2 78.62,31.3 78.62,31.57 77.6,32.6 70.3,32.6 70,32.3 69.8,32.3 69.7,32.4 69.7,32.8 69.6,32.9 69.4,32.9 69.3,32.8 69.3,32.4 69.2,32.3 69,32.3 68.9,32.4 68.9,32.8 68.8,32.9 68.6,32.9 68.5,32.8 68.5,32.4 68.4,32.3 68.2,32.3 68.1,32.4 68.1,32.8 68,32.9 67.8,32.9 67.7,32.8 67.7,32.4 67.6,32.3 64.4,32.3 63.4,33.3 U1.57
D13
  Top 0.2: U2.62 78.9,28.7 78.7,28.9 78.7,29.1 78.8,29.2 79.4,29.2 79.5,29.3 79.5,29.5 79.4,29.6 78.8,29.6 78.7,29.7 78.7,29.9 78.8,30 79.4,30 79.5,30.1 79.5,30.3 79.4,30.4 78.8,30.4 78.7,30.5 78.7,30.7 78.8,30.8 79.33,30.8 79.5,30.98 79.5,31.3 77.8,33 70.5,33 70.2,33.3 67.4,33.3 67.3,33.2 67.3,32.8 67.2,32.7 67,32.7 66.9,32.8 66.9,33.2 66.8,33.3 66.6,33.3 66.5,33.2 66.5,32.8 66.4,32.7 66.2,32.7 66.1,32.8 66.1,33.2 66,33.3 65.8,33.3 65.7,33.2 65.7,32.8 65.6,32.7 65.4,32.7 65.3,32.8 65.3,33.2 65.2,33.3 65,33.3 64.9,33.2 64.9,32.8 64.8,32.7 64.6,32.7 63.6,33.7 U1.58
D14
  Top 0.2: U2.63 79.55,28.75 79.7,28.9 80.3,28.9 80.4,29 80.4,29.2 80.3,29.3 80.1,29.3 80,29.4 80,29.6 80.1,29.7 80.3,29.7 80.4,29.8 80.4,30 80.3,30.1 80.1,30.1 80,30.2 80,30.4 80.1,30.5 80.3,30.5 80.4,30.6 80.4,31 78,33.4 70.7,33.4 70.5,33.6 70.5,34.1 70.4,34.2 70.2,34.2 70.1,34.1 70.1,33.8 70,33.7 69.8,33.7 69.7,33.8 69.7,34.1 69.6,34.2 69.4,34.2 69.3,34.1 69.3,33.8 69.2,33.7 69,33.7 68.9,33.8 68.9,34.1 68.8,34.2 68.6,34.2 68.5,34.1 68.5,33.8 68.4,33.7 68.2,33.7 68.1,33.8 68.1,34.1 68,34.2 67.8,34.2 67.7,34.1 67.7,33.8 67.6,33.7 67.4,33.7 67.3,33.8 67.3,34.1 67.2,34.2 67,34.2 66.9,34.1 66.9,33.8 66.8,33.7 66.6,33.7 66.3,34 66.1,34 65.8,33.7 65.6,33.7 64.8,34.5 U1.60
D15  (via drill 0.4)
  Top 0.2: U2.65 80.85,31.15 78.2,33.8 71,33.8 70.9,33.9 70.9,34.1 71,34.2 73.17,34.2 73.28,34.3 73.28,34.5 73.17,34.6 v65.7,34.6 | U1.59 64.2,34.1 v64.5,33.8
  Bottom 0.2: v64.5,33.8 65.3,34.6 v65.7,34.6
DCDC_VDDA  (via drill 0.4)
  Top 0.2: U1.110 33.5,30.9 v33.1,30.5 | U1.96 36.7,38.4 36.4,38.7 34.7,38.7 34.1,39.3 34.1,41.28
  Top 0.5: v33.1,30.5 32.44,30.5 C25.2 | C17.2 34.1,42.18 34.1,41.28
  Top 0.6: 31.7,42.8 33.5,42.8 C17.2 | v30.8,42.8 31.7,42.8 | 31.7,42.8 C18.2
  Bottom 0.2: v30.8,42.8 29.7,42.8 27.4,40.5 23.4,40.5 22.8,39.9 22.8,34.1 23.5,33.4 30.2,33.4 v33.1,30.5
DCDC_VDDD  (via drill 0.4)
  Top 0.2: 37.9,39.9 U1.93 | 36.54,20.91 36.7,21.07 U1.1 | 37.5,39.9 U1.94
  Top 0.3: 38.8,40.33 38.85,40.38 38.85,41.46
  Top 0.4: 38.85,41.46 C14.2 | 38.8,40.33 38.38,39.9 37.9,39.9 37.5,39.9 v35.15,39.9
  Top 0.5: 36.54,20.91 C1.2 34.4,20.91 | C2.2 34.4,20.91 | 34.4,20.91 v34.4,22.55
  Top 0.8: C14.2 40.97,41.71 C13.2
  Bottom 0.2: v34.4,22.55 34.2,22.75 34.2,30.35 33.1,31.45 33.1,32 36,34.9 37.2,34.9 37.7,35.4 37.7,36.5 35.15,39.05 v35.15,39.9
DCDC_VDDIO
  Top 0.2: U1.95 37.1,38.6 36.6,39.1 34.9,39.1 34.5,39.5 34.5,40.5 34.6,40.6 35.01,40.6 R1.2
  Top 0.5: C16.2 37.27,42.78 C15.2 35.6,41.19 R1.2
DEBUG  (via drill 0.4)
  Top 0.2: U1.89 39.5,38.6 39.65,38.75 40.25,38.75 v40.45,38.95 | v35.85,46.3 35.35,46.8 30.6,46.8 30.4,46.6 v30.3,46.6 | v18.8,20.6 21.3,20.6 24.3,23.6 v24.3,24
  Bottom 0.2: v40.45,38.95 40.7,39.2 40.7,41.45 v35.85,46.3 | v30.3,46.6 29,46.6 26.7,44.3 23.8,44.3 21.2,41.7 21.2,27.1 v24.3,24 | v18.8,20.6 15,20.6 12.81,18.41 6.21,18.41
  Bottom 1: 6.21,18.41 SJTAG.4 U_DEBUG.4
DQM0  (via drill 0.4)
  Top 0.2: U1.46 52.05,28.9 v52.3,29.15 | U2.20 69.15,37.95 v67.1,35.9
  Bottom 0.2: v52.3,29.15 52.3,30.4 52,30.7 52,37.2 55.7,40.9 56.6,40.9 61.6,35.9 v67.1,35.9
DQM1  (via drill 0.4)
  Top 0.2: U2.47 69.15,28.65 68.9,28.9 67.8,28.9 67.05,29.65 v66.05,29.65 | U1.56 62.8,32.9 v63.1,32.6
  Bottom 0.2: v63.1,32.6 v66.05,29.65
DQS0  (via drill 0.4)
  Top 0.2: U1.39 51.8,26.1 52.65,25.25 v52.65,25.15 | v71.75,38.2 U2.16
  Bottom 0.2: v52.65,25.15 52.65,24.75 53.3,24.1 57.5,24.1 57.9,24.5 57.9,25.12 57.8,25.23 57.8,27.5 58.5,28.2 59.9,28.2 60.3,27.8 60.3,25.4 61,24.7 65.5,24.7 66.9,26.1 66.9,30.2 71.75,35.05 v71.75,38.2
DQS1  (via drill 0.4)
  Top 0.2: U1.40 52,26.5 52.7,25.8 57.3,25.8 57.8,25.3 57.8,25.23 58.33,24.7 v58.33,23.95 | v72.25,29.2 71.75,28.7 U2.51
  Bottom 0.2: v58.33,23.95 58.73,23.95 59.98,22.7 66.5,22.7 68.9,25.1 68.9,25.85 v72.25,29.2
GND  (via drill 0.4, 0.6)
  Top 0.2: U1.35 51.62,24.5 52.42,23.7 | U1.105 33.9,32.9 33.65,33.15 33.12,33.15 32.95,33.33 | 36.3,36.5 36.3,35.8 36.2,35.7 | 36.2,35.7 U1.98 | 48.55,20.35 48.3,20.6 U1.30 | 31.04,27.85 31.19,27.7 U1.118 | U1.112 33.9,30.1 33.2,29.4 30.61,29.4 | 36.2,36.6 36.2,35.7
  Top 0.4: 69.8,26.3 U2.48 | 81.5,31.6 U2.66 | 80.2,26.7 U2.64 | 78.25,40.65 U2.6 | 74.35,40.85 U2.12 | 60.5,28.35 60.7,28.35 U2.34 | 76.3,26.7 U2.58 | 72.4,26.8 U2.52
  Top 0.5: 69.8,26.3 69.2,25.7 69.2,23.5 69.3,23.4 69.91,23.4 C39.1 R19.1 v71.8,21.9 | 81.5,31.6 80.9,32.2 80.9,35.9 81.71,36.71 C30.1 83.3,35.5 v82.8,35 | 80.2,26.7 80.5,26.4 81.9,26.4 83.4,27.9 C33.1 v82.5,31.41 | 78.25,40.65 78.25,41.86 C34.1 v79.3,41.9 | 74.35,40.85 74.35,41.86 C35.1 v75.3,41.9 | C31.1 v68,41.9 C32.1 | 60.5,28.35 v57.2,28.35 56.34,28.35 C6.1 | v57.2,31.25 C7.1 | 52.42,23.7 55.8,23.7 56.02,23.93 56.02,24.64 C5.1 56.34,24.85 v57.2,24.85 57.2,23.7 56.45,22.95 56.45,22.8 | 76.3,26.7 76.7,26.3 77.5,26.3 78.5,25.3 78.5,23.11 | 78.5,23.11 C37.1 80.5,23.11 | 78.5,23.11 C36.1 76.45,22.86 76.45,22.55 75.8,21.9 v71.8,21.9 | v73.5,26.2 73,26.2 72.4,26.8 | 80.5,23.11 82.69,23.11 C29.1 83.7,24.12 83.7,24.9 84,25.2 86.1,25.2 87.1,24.2 v87.1,23.3 | JTAG.3 82.97,2.23 81.16,4.04 | 30.48,33.33 C19.1 C20.1 | 30.48,33.33 C8.1 30.48,30.32 C25.1 30.41,30.19 30.61,29.99 30.61,29.4 C26.1 30.61,28.5 | 30.48,33.33 32.95,33.33 | C23.1 22.99,24.7 T2.2 21.25,22.96 R10.2 21.19,21.99 20.7,21.5 17,21.5 16.4,22.1 16.4,23 18.2,24.8 18.2,29.85 T1.2 T1.1 23.4,31 | 23.4,31 C24.1 | 23.4,31 23.4,32 25.21,33.81 C12.1 25.21,35.5 23,35.5 22.6,35.9 22.38,35.9 22.38,36.12 C11.1 22.2,35.9 13.88,35.9 | 35.6,37.2 v35.6,37.3 | v36,36.8 36.2,36.6 36.3,36.5 | 56.45,22.8 53.4,22.8 49.6,19 48.55,19 | 56.45,22.8 56.45,22.15 57.3,21.3 67.7,21.3 68.3,21.9 71.2,21.9 | R14.1 C4.1 44.51,46.1 43.81,46.1 C3.1 42.87,45.39 C13.1 39.73,43.62 39.6,43.49 C14.1 38.9,43.69 38.9,44 38.5,44.4 37.69,44.4 C16.1 37.27,44.82 C15.1 | USB_HOST.4 33.12,10.43 L3.1 33.8,11.12 33.8,11.5 34.4,12.1 36.9,12.1 37.6,11.4 39,11.4
  Top 0.5: 71.2,21.9 v71.8,21.9 | 62.3,50.67 RM2.1.1 | 62.3,49.78 RM2.2.1 | 62.3,49.78 62.3,50.67 | 62.3,49.02 RM2.3.1 | 62.3,49.02 62.3,49.78 | 62.3,48.13 RM2.4.1 | 62.3,48.13 62.3,49.02 | 62.3,50.67 62.3,51.44 | 0.8,36.21 R43.2 | 0.8,36.21 0.8,34.2 C69.2 | 0.8,36.21 0.8,39.59 R48.2 1.3,40.09 1.3,40.8 1.7,41.2 v3.2,41.2 | R44.2 v12.5,38.1 C75.2 13.88,36.51 | 13.88,36.51 U5.4 | 13.88,35.9 13.88,36.51 | 28.9,22.5 v28.9,23.1 | 28.9,22.5 28.9,21.31 C41.2 26.99,16.64 | D3.A 9.95,13.97 9.95,13.8 | 9.95,13.8 FET1.1 | 26.99,16.64 U3.3 | v26.99,16.4 26.99,16.64 | U6.2 4.5,45.2 4.92,45.62 5.31,45.62 C73.2 v6.9,46.02 | 48.55,19 48.55,20.35 | 30.61,28.5 30.61,28.39 30.86,28.14 30.86,28.02 31.04,27.85 | v29.5,28.5 30.61,28.5 | C2.1 C1.1 35.7,17.66 36.07,17.3 C76.- 36.77,14.5 44.05,14.5 48.55,19 | 80.5,23.11 80.5,20.59 RM1.4.1 | C18.1 31.83,44.82 | C22.1 30.09,22.5 28.9,22.5 | C78.2 39.71,11.4 39,11.4 | COMPOSITE_VIDEO.GND3 39,11.4 | v11,13.8 9.95,13.8 | C67.1 | 18.09,5.21 18.5,4.8 18.5,3.2 | 18.5,3.2 R2.1 | R7.1 R20.2 R8.1 73.01,15 72.3,15 71.2,16.1 71.2,21.9 | 18.5,3.2 18.5,2 18.9,1.6 41.6,1.6 | v82.7,43.1 83.8,43.1 85.3,41.6 89.8,41.6 | C40.2 89.91,41.6 89.8,41.6 | 89.8,41.6 GND_PIN.P$1 | 62.3,48.13 62.3,46.9 63,46.2 63.9,46.2 v64.9,45.2 | 13.88,35.9 C72.2
  Top 0.7: v35.2,36.8 35.6,37.2 v36,36.8 v35.2,36.8
  Top 0.8: 81.16,4.04 SD.6 | C9.1 25.08,40.97 C10.1 | GPIO_CON.40 62.3,51.44 62.87,52 69.3,52 69.86,51.44 UEXT.2 | LIPO_BAT.2 C67.1 | LINE_IN.5 58.21,3.6 49.4,3.6 49,4 | 49,4 COMPOSITE_VIDEO.GND1 | 49,4 COMPOSITE_VIDEO.GND2 41.6,1.6
  Top 1: C12.1 25.6,35.69 v25.6,38 25.6,38.78 C10.1 | 30.21,38 C21.1 | C20.1 30.48,38 30.21,38 | 30.21,38 v29.4,38 | v30.45,44.45 31.46,44.45 C18.1 | C15.1 C17.1 31.83,44.82 | PWR.-- 18.09,5.21 | C68.- 16.3,8.9 v16,8.6 | C9.1 v25.2,42.1
  Bottom 0.5: 79.3,42.7 75.3,42.7 | v57.2,31.25 v57.2,28.35 v57.2,24.85 | v71.8,21.9 71.8,24.5 v73.5,26.2 78.71,31.41 79.3,31.41 | 11.4,46.02 11.4,43.8 12.5,42.7 v12.5,38.1 | C76.- 34.77,16.5 27.09,16.5 v26.99,16.4 | 11.4,46.02 v6.9,46.02 6.32,46.02 3.2,42.9 v3.2,41.2 | 11.4,46.02 11.4,50.13 11.8,50.53 | v29.5,28.5 28.9,27.9 v28.9,23.1 | 79.3,42.7 v79.3,41.9 79.3,31.41 | 79.3,42.7 82.3,42.7 v82.7,43.1 | 68,42.7 67.4,42.7 v64.9,45.2 | 75.3,42.7 v75.3,41.9 | 75.3,42.7 68,42.7 | 68,42.7 v68,41.9 | JTAG.3 82.97,15.47 86.9,19.4 86.9,23.1 v87.1,23.3 | 79.3,31.41 v82.5,31.41 | v82.5,31.41 v82.5,31.4 | v82.5,31.41 82.8,31.71 v82.8,35
  Bottom 0.7: v36,36.8 36,36.9
  Bottom 1: v25.6,38 v29.4,38 32.8,38 34,36.8 v35.2,36.8 v36,36.8 | v25.2,42.1 26.9,42.1 29.25,44.45 v30.45,44.45 | 36,36.9 v35.6,37.3 35.2,36.9 | USB_HOST.4 33.12,8.52 36.07,11.47 C76.- | 11.8,50.53 GPIO_CON.2 | U_DEBUG.3 2.12,15.88 4.67,13.34 SJTAG.2 10.54,13.34 v11,13.8 15.86,13.8 C68.- | 12.14,5.21 PWR.- | 12.14,5.21 14.96,5.21 | 14.96,5.21 PWR.-- | LIPO_BAT.2 7.38,3.17 9.41,5.21 12.14,5.21 | 14.96,5.21 14.96,7.56 v16,8.6
  Bottom 2: COMPOSITE_VIDEO.GND2 41.1,4 39,6.1 COMPOSITE_VIDEO.GND3
  other vias: 92.4,19.1
  pour Top (isolate 0.4, rank 2): -1.5,56 -1.5,-1.5 95.5,-1.5 95.5,56
  pour Bottom (isolate 0.4, rank 3): -2.5,-2.5 96.5,-2.5 96.5,57 -2.5,57
HP_VGND  (via drill 0.4)
  Top 0.2: U1.111 36.12,30.5 36.42,30.8 v37.1,30.8 | v70.2,16.2 71.4,15 71.4,6.7 | HEADPHONES.5 70.27,5.25 70.75,5.25 71.4,5.9 71.4,6.7 | 71.4,6.7 R3.1
  Top 0.5: R3.1 R4.1
  Bottom 0.2: v37.1,30.8 37.5,30.4 37.5,26.2 40,23.7 42.7,23.7 47.8,18.6 49.6,18.6 50.6,17.6 68.8,17.6 v70.2,16.2
I2C_SCL  (via drill 0.4)
  Top 0.2: SCL_HW/SCL_SW.2 39.9,47.4 v42.8,47.4
  Top 0.8: UEXT.5 76.2,46.79 R11.1
  Bottom 0.2: v42.8,47.4 43.6,46.6 54,46.6 54.7,45.9 74.5,45.9 76.2,47.6
  Bottom 1: 76.2,47.6 UEXT.5
I2C_SDA  (via drill 0.4)
  Top 0.2: 77.5,50.13 77.5,48.09 78.2,47.39 78.2,46.59 R12.1 | SDA_HW/SDA_SW.2 39.9,46 42.1,46 42.6,46.5 43,46.5 v43.9,47.4
  Top 0.8: UEXT.6 77.5,50.13
  Bottom 0.2: v43.9,47.4 44.3,47 54.2,47 54.9,46.3 73.9,46.3 74.9,47.3 74.9,50.13
  Bottom 1: 74.9,50.13 UEXT.6
LED1  (via drill 0.4)
  Top 0.2: U1.88 39.9,36.7 39.8,36.6 39.6,36.6 37.45,34.45 v37.45,34.05 | 21.17,5.83 21.5,5.5 21.5,4.2 23,2.7 28.1,2.7 31.9,6.5 31.9,9.7 32.5,10.3 32.5,11.7 33.3,12.5 33.3,13.4 34.8,14.9 34.8,16.06 33.2,17.66 33.2,22.4 34,23.2 35.75,23.2 v36,22.95
  Top 1: 21.17,5.83 LED1.A
  Bottom 0.2: v36,22.95 36,23.8 35,24.8 35,33.3 36.2,34.5 37,34.5 v37.45,34.05
N$1
  Top 0.5: 88.6,51.23 R22.1 R25.1
  Top 0.8: 88.6,51.23 PWR/REC.2
N$2
  Top 0.5: R29.2 R27.1 25.59,12.19 26.79,13.39 26.8,13.39 26.8,14.5 27.66,15.37 U3.2
N$4
  Top 0.5: C78.1 44,12.6 | 44,12.6 COMPOSITE_VIDEO.IO | 44,12.6 R26.2
N$6  (via drill 0.4)
  Top 0.5: LINE_IN.2 59.77,13.87 61.5,15.6 67.2,15.6 69.3,17.7 v70.3,17.7 | v72.1,17.7 73.11,17.7 R5.2
  Bottom 0.5: v70.3,17.7 v72.1,17.7
N$7
  Top 0.4: U2.49 70.45,26.7 71.05,26.1 71.5,26.1 71.8,25.8 R19.2 | C39.2 R19.2 | R19.2 R18.1 C38.2
N$15  (via drill 0.4)
  Top 0.2: U1.113 36.12,29.7 36.33,29.9 v36.75,29.9
  Top 0.5: v69.2,16.2 69.2,14.05 HEADPHONES.2 70.3,12.95 v70.3,11.6 | v76.2,10.8 76.2,6.8 76.1,6.7 R3.2
  Bottom 0.2: v36.75,29.9 37.1,29.55 37.1,26 39.8,23.3 42.5,23.3 47.6,18.2 49.4,18.2 50.4,17.2 68.2,17.2 v69.2,16.2
  Bottom 0.5: v76.2,10.8 71.1,10.8 v70.3,11.6
N$18
  Top 0.2: U1.97 34.9,36.1 | 34.9,36.1 34.7,36.1 | 34.7,36.1 34.5,36.1 34.4,36.2 | 34.7,36.1 34.4,36.4 | 34.9,36.1 34.4,36.6
  Top 0.4: 34.4,36.2 34.4,36.4 34.4,36.6 34.4,38.2 33.6,39 33.6,40.7 32.4,41.9 30.48,41.9 | 30.48,41.9 30.2,41.9 30,42.1 | 30.48,41.9 30.07,42.3
  Top 0.8: L1.2 28.44,43.66 30,42.1
N$19
  Top 0.2: U1.99 34.2,35.3 33.9,35.6 | 33.8,35.85 33.8,35.7 33.9,35.6 | 33.9,35.6 33.9,35.85
  Top 0.4: 33.8,35.85 33.8,37.9 33,38.7 33,40.3 32,41.3 29.3,41.3 28.5,42.1 26.61,42.1 25.11,43.6 24.54,43.6
  Top 1: L1.1 23.24,43.6 24.54,43.6
N$21  (via drill 0.4)
  Top 0.2: v33.8,31.7 34.2,31.3 U1.109 | v51,15.75 51,13.6 57.7,6.9 58.5,6.9
  Top 0.5: R4.2 75.09,3.79 74.8,3.5 v72.1,3.5
  Top 0.8: 58.5,6.9 61.95,6.9 HEADPHONES.3 62.69,5.41 62.39,5.11 v62.39,3.91
  Bottom 0.2: v33.8,31.7 33.8,31.5 34.6,30.7 34.6,23.4 35.7,22.3 38.3,22.3 38.9,21.7 41.7,21.7 47.65,15.75 v51,15.75
  Bottom 0.5: v72.1,3.5 62.8,3.5 v62.39,3.91
N$23  (via drill 0.4)
  Top 0.5: 16.5,34.5 C72.1 | 16.5,34.5 5V_E.1 | 16.5,34.5 16.5,25.8 15.1,24.4 13.39,24.4 L2.2 10.63,24 v7.9,24 | v4.7,38.1 R45.2
  Bottom 0.5: v4.7,38.1 7.9,34.9 v7.9,24
N$25
  Top 0.2: U1.117 32.84,28.1 C26.2
N$29  (via drill 0.4)
  Top 0.2: v72.3,8.3 R6.2
  Top 0.5: LINE_IN.3 52.27,6.66 51.97,6.96 v51.97,8.3
  Bottom 0.2: 52.7,8.3 v72.3,8.3
  Bottom 0.5: v51.97,8.3 52.7,8.3
N$31
  Top 0.5: 12.14,9.86 11.5,10.5 FET1.3
  Top 1: 12.14,9.86 PWR.+
N$32
  Top 0.5: R6.1 C28.1 R7.2
N$33
  Top 0.5: R8.2 C27.1 R5.1
N$34  (via drill 0.4)
  Top 0.2: U1.115 36.3,28.9 v36.45,29.05
  Top 0.5: v72.3,16.3 C27.2
  Bottom 0.2: v36.45,29.05 36.45,26.05 39.6,22.9 42.3,22.9 47.4,17.8 49.2,17.8 50.2,16.8 67.6,16.8 68.9,15.5 71.5,15.5 v72.3,16.3
N$35  (via drill 0.4)
  Top 0.2: U1.114 34.05,29.3 v33.5,28.75 | C28.2 72.3,9.9 72.1,10.1 v72.1,14.15
  Bottom 0.2: v33.5,28.75 33.5,22.5 34.1,21.9 38.1,21.9 38.7,21.3 41.5,21.3 47.7,15.1 51.4,15.1 52.3,16 67.2,16 69.05,14.15 v72.1,14.15
N$36
  Top 0.5: C69.1 4.71,32.7 U5.8
N$37
  Top 0.5: R42.2 3.59,31.7 7.3,31.7 7.7,32.1 7.7,33.5 7.24,33.97 U5.7
N$38
  Top 0.5: C40.1 92,42.09 R24.1
N$42
  Top 0.5: LED1.K 18.63,6.73 20.79,4.57 R2.2
N$43  (via drill 0.4)
  Top 0.2: v17.3,22.5 18.89,22.5 19.35,22.96
  Top 0.4: R10.1 19.35,22.96 T2.1 | R9.1 4.5,48.81 4.5,48.5 v3.6,47.6
  Bottom 0.2: v17.3,22.5 16.3,22.5 12.7,18.9 7,18.9 5.7,20.2 5.7,21.2 7,22.5 7,29.5 1.5,35 1.5,43.6 3.6,45.7 v3.6,47.6
N$46
  Top 0.5: U5.1 11.9,32.7 12.5,32.1 C70.1
N$50
  Top 0.5: U5.3 12.37,35.23 12.7,34.9 12.7,33.5 13,33.2 14.9,33.2 15.09,33.01 C70.2 15.09,30.99 14.6,30.5 13.29,30.5 L2.1
N$60
  Top 0.5: C71.1 4.48,35.23 U5.6
N$61
  Top 0.5: R43.1 C71.2
N$62
  Top 0.5: U5.5 7.11,36.51 7.4,36.8 7.4,37.81 R45.1 R44.1
N$64
  Top 0.5: U6.3 4,46.15 4,46.7 4.6,47.3 7.1,47.3 7.8,46.6 7.8,44.71 L5.1
N$65
  Top 0.5: 3.3V_E.1 C75.1 15.8,38.22 15.8,41.81 L5.2 12.9,41.65 12.9,40 12.5,39.6 6.59,39.6 C74.1 R47.1
N$66
  Top 0.5: R48.1 C74.2 R47.2 4.51,41.79 3.95,42.35 3.45,42.35 1.55,44.25 U6.5
N$101
  Top 0.2: 69.03,50.67 69.8,49.9 69.8,47.8 70.2,47.4 D03_H.1
  Top 0.4: RM3.1.2 69.03,50.67
N$103
  Top 0.2: 68.92,49.78 69.4,49.3 69.4,46.88 D02_H.1
  Top 0.4: RM3.2.2 68.92,49.78
N$104
  Top 0.2: 68.88,49.02 69,48.9 69,47.58 D01_H.1
  Top 0.4: 68.88,49.02 RM3.3.2
N$105
  Top 0.2: RM3.4.2 67.2,47.17 67.2,46.88 D00_H.1
N$266
  Top 0.5: L3.2 35.52,5.36 USB_HOST.P$1
  Bottom 1: USB_HOST.P$2 USB_HOST.P$1
PIN1/LCD_D00  (via drill 0.4)
  Top 0.2: v52.85,44.25 53.45,44.25 56.5,47.3 56.5,48 | v46.15,29.9 44.6,29.9 43.4,31.1 41.2,31.1 37.1,27 U1.2
  Top 0.4: 65.73,48.13 RM2.4.2 | 65.73,48.13 RM3.4.1 | v65.73,47.8 65.73,48.13
  Top 1: 56.5,48 56.5,48.27 GPIO_CON.35
  Bottom 0.2: 56.67,48.1 56.98,47.8 v65.73,47.8 | v52.85,44.25 52.85,43.45 47.3,37.9 47.3,34.1 47.6,33.8 47.6,30.9 46.6,29.9 v46.15,29.9
  Bottom 1: GPIO_CON.35 56.67,48.1
PIN2/LCD_D01  (via drill 0.4)
  Top 0.2: v45.5,29.25 44.65,29.25 43.2,30.7 41.4,30.7 37.5,26.8 U1.3
  Top 0.4: 65.7,49.02 RM2.3.2 | v65.7,48.9 65.7,49.02 | 65.7,49.02 RM3.3.1
  Top 0.5: v51.55,45.55 51.55,46.38 53.34,48.16 53.34,48.34
  Top 0.8: 53.34,48.34 GPIO_CON.33
  Bottom 0.2: 54.6,50.16 61.65,50.16 62.9,48.9 v65.7,48.9 | v51.55,45.55 51.8,45.8 53.6,45.8 54,45.4 54,44 47.7,37.7 47.7,34.3 48,34 48,30.6 46.65,29.25 v45.5,29.25
  Bottom 1: GPIO_CON.33 54.6,50.16
PIN3/LCD_D02  (via drill 0.4)
  Top 0.2: U1.4 37.9,26.6 41.6,30.3 43,30.3 44.7,28.6 v46.12,28.6 | v50.25,45.9 50.25,47.05 50.8,47.6
  Top 0.4: 65.7,49.78 RM2.2.2 | v65.7,49.8 65.7,49.78 | 65.7,49.78 RM3.2.1
  Top 0.8: 50.8,47.6 GPIO_CON.31
  Bottom 0.2: 52,50.09 52,51.8 52.8,52.6 62.9,52.6 v65.7,49.8 | v46.12,28.6 46.6,28.6 48.4,30.4 48.4,34.2 48.1,34.5 48.1,37.5 54.4,43.8 54.4,45.6 53.8,46.2 50.55,46.2 v50.25,45.9
  Bottom 1: GPIO_CON.31 52,50.09
PIN4/LCD_D03  (via drill 0.4)
  Top 0.2: U1.5 38.3,19.3 37.5,18.5 v37.5,15.35
  Top 0.4: 65.7,50.67 RM2.1.2 | v65.7,50.8 65.7,50.67 | 65.7,50.67 RM3.1.1
  Bottom 0.2: 64.9,53.1 47.8,53.1 47.1,52.4 47.1,50.05 | 64.9,53.1 64.9,51.6 v65.7,50.8 | v37.5,15.35 37.5,12.7 38,12.2 39.1,12.2 40.8,13.9 52,13.9 52.9,14.8 66.6,14.8 68.7,12.7 75,12.7 79.4,17.1 83,17.1 85.9,20 85.9,41.5 86.5,42.1 86.5,45.1 85.1,46.5 85.1,50.9 82.1,53.9 65.4,53.9 64.9,53.4 64.9,53.1
  Bottom 1: 47.1,50.05 GPIO_CON.29
PIN5/LCD_D04  (via drill 0.4)
  Top 0.2: U1.6 38.7,23.8 38.3,24.2 38.3,26.4 41,29.1 v41.35,29.1 | v37.4,47.6 36.9,48.1 36.9,49.6 37.41,50.12 44.5,50.12
  Top 1: 44.5,50.12 GPIO_CON.27
  Bottom 0.2: v41.35,29.1 41.3,29.15 41.3,34.5 41.9,35.1 41.9,42.4 37.4,46.9 v37.4,47.6
PIN6/LCD_D05  (via drill 0.4)
  Top 0.2: R14.2 46.69,44.9 47,44.9 47.2,45.1 47.2,47.1 46.7,47.6 45.1,47.6 | U1.7 39.1,24 38.7,24.4 38.7,26.25 40.85,28.4 41.6,28.4 42.1,28.9 v42.1,29.65 | v38.25,47.15 38.9,47.8 41.4,47.8 41.5,47.9
  Top 0.4: 41.5,47.9 42.1,47.9 42.1,48.2
  Top 0.8: 43.8,48.9 45.1,47.6
  Top 1: 43.8,48.9 GPIO_CON.25 42.8,48.9 42.1,48.2
  Bottom 0.2: v42.1,29.65 42.1,30.4 41.7,30.8 41.7,34.3 42.3,34.9 42.3,42.6 38.25,46.65 v38.25,47.15
PIN7/LCD_D06  (via drill 0.4)
  Top 0.2: U1.8 39.5,24.2 39.1,24.6 39.1,26.1 41,28 41.8,28 42.3,28.5 43.2,28.5 v43.85,27.85
  Bottom 0.2: v43.85,27.85 43.6,28.1 43.6,30.8 42.9,31.5 42.9,33.7 43.5,34.3 43.5,44.05 40.64,46.91 40.64,47.26
  Bottom 1: 40.64,47.26 GPIO_CON.23
PIN8/LCD_D07  (via drill 0.4)
  Top 0.2: U1.9 39.9,24.4 39.5,24.8 39.5,25.9 41.2,27.6 42.35,27.6 v42.55,27.8
  Bottom 0.2: v42.55,27.8 42.8,28.05 42.8,30.3 42.1,31 42.1,34.1 42.7,34.7 42.7,42.8 39.1,46.4 39.1,47.7 38.5,48.3
  Bottom 1: 38.5,48.3 38.1,48.7 GPIO_CON.21
PIN9/LCD_D08/SSP2_MISO  (via drill 0.4)
  Top 0.2: U1.22 45.1,24.32 v45.58,24.8
  Bottom 0.2: 35.56,47.54 41.1,42 41.1,35.5 40.5,34.9 40.5,30.2 40.3,30 40.3,28.5 42.55,26.25 43.75,26.25 45.2,24.8 v45.58,24.8 46.05,24.32 46.27,24.32 51.4,19.2 82.1,19.2 83.9,21 83.9,48.3 82,50.2 80.05,50.2
  Bottom 1: 35.56,47.54 GPIO_CON.19 | 80.05,50.2 UEXT.7
PIN10/LCD_D09  (via drill 0.4)
  Top 0.2: U1.23 45.5,23.4 v45.8,23.7